# EAGLE schematic Yaris speed door lock (EAGLE 9.2.2)
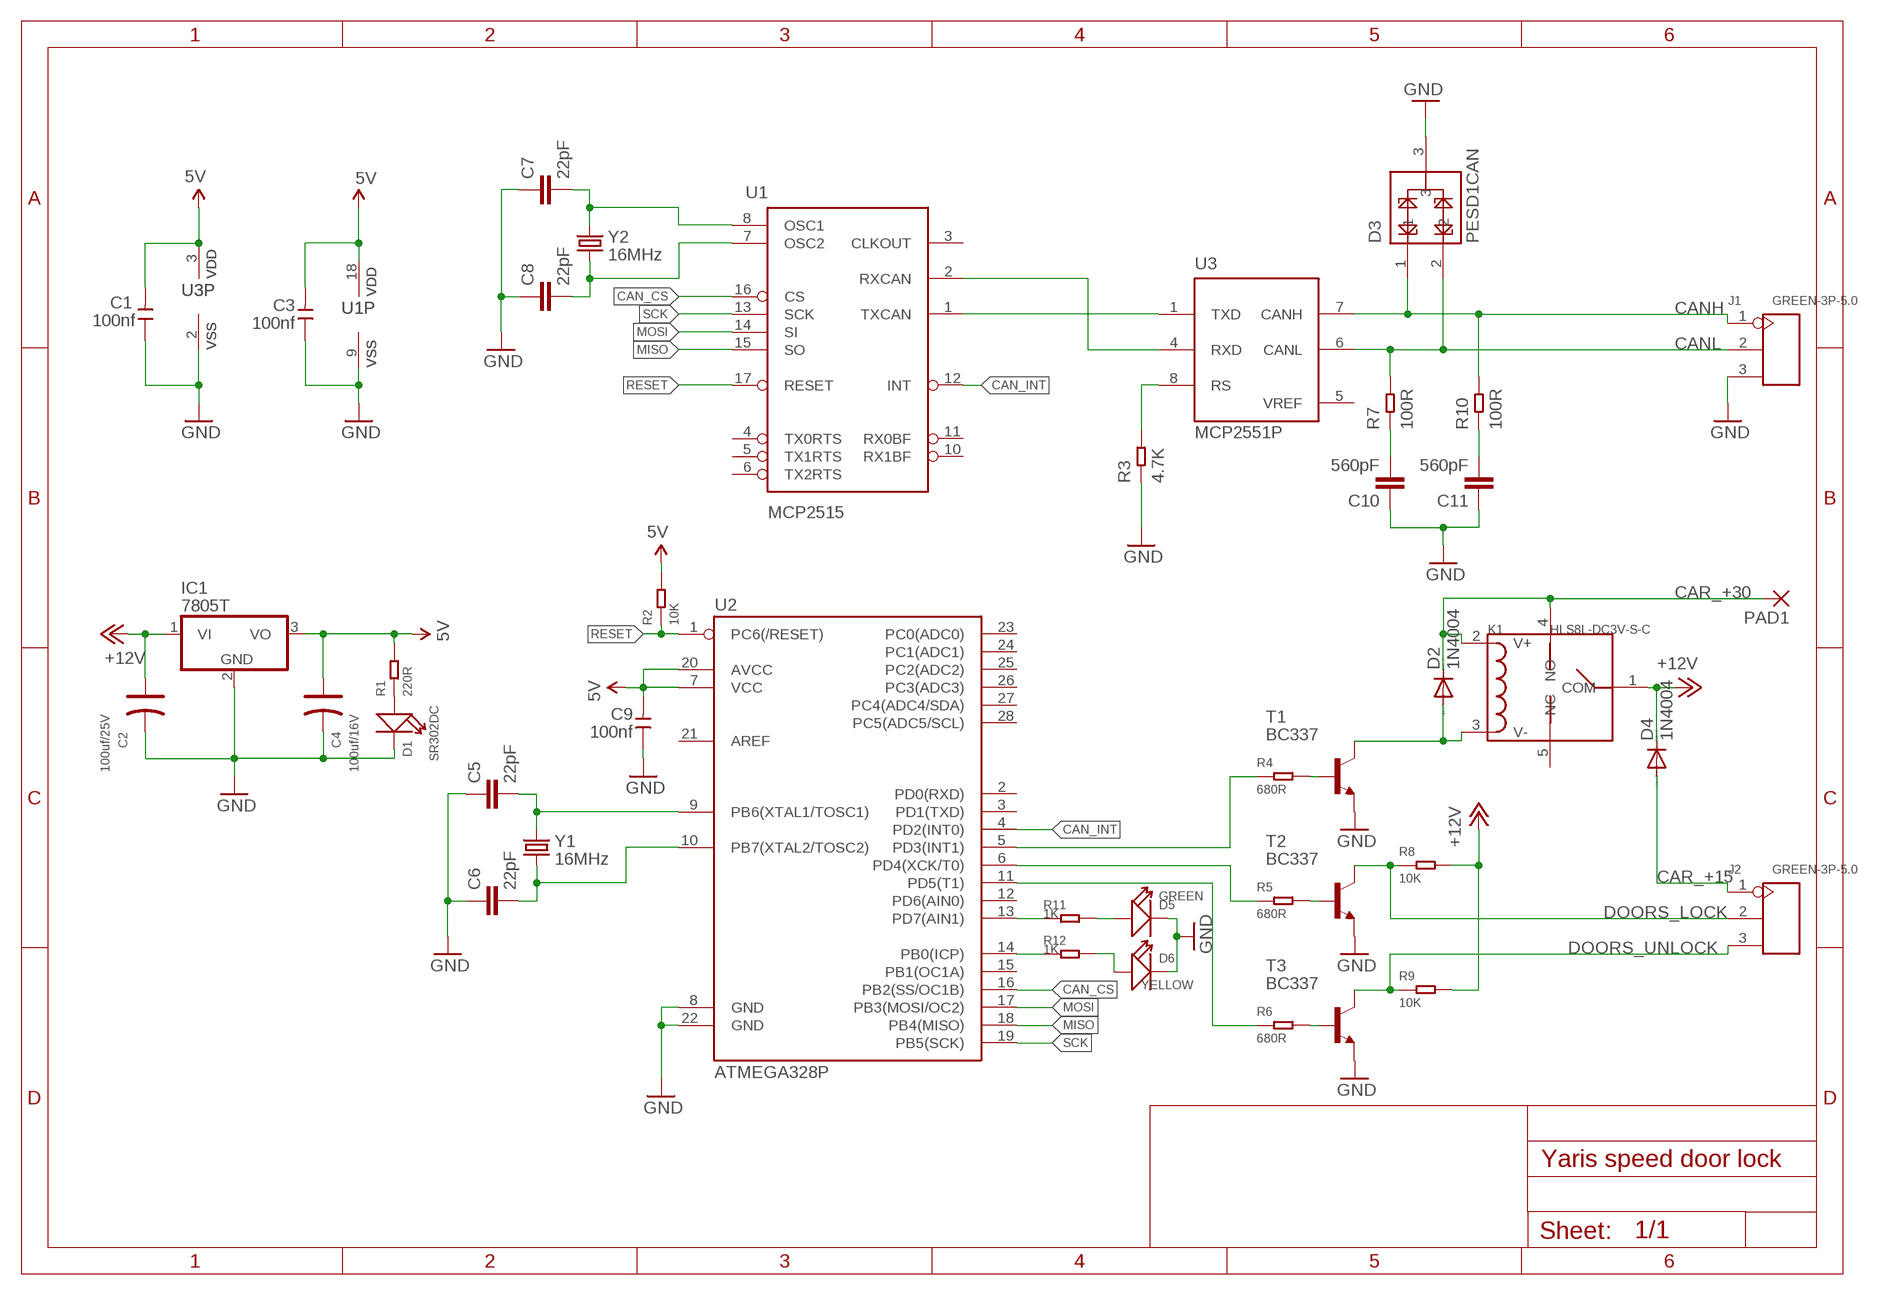
[diagram p0: schematic, sheet 1]

## Parts
C1  100nf  DIP-CERAMIC-DISC-100NF-50V-Y5V(D5.0MM)  [CERAMIC-2.54]
C2  100uf/25V  DIP-ALUMINUM-100UF-16V(D5-H7MM)  [PC-D5.3MM]
C3  100nf  DIP-CERAMIC-DISC-100NF-50V-Y5V(D5.0MM)  [CERAMIC-2.54]
C4  100uf/16V  DIP-ALUMINUM-100UF-16V(D5-H7MM)  [PC-D5.3MM]
C5  22pF  22PF-PTH-2.54MM-200V-5%  [CAP-PTH-2.54]
C6  22pF  22PF-PTH-2.54MM-200V-5%  [CAP-PTH-2.54]
C7  22pF  22PF-PTH-2.54MM-200V-5%  [CAP-PTH-2.54]
C8  22pF  22PF-PTH-2.54MM-200V-5%  [CAP-PTH-2.54]
C9  100nf  DIP-CERAMIC-DISC-100NF-50V-Y5V(D5.0MM)  [CERAMIC-2.54]
C10  560pF  560PF-50V-5%(0603)  [0603-CAP]
C11  560pF  560PF-50V-5%(0603)  [0603-CAP]
D1  SR302DC  DIP-LED-RED-RED(2P-D3MM)  [LED2-2.54-D3.0MM]
D2  1N4004  [DO41-10]
D3  PESD1CAN  [SOT23-3]
D4  1N4004  [DO41-10]
D5  GREEN  DIP-LED-GREEN-GREEN(2P-D3MM)  [LED2-2.54-D3.0MM]
D6  YELLOW  DIP-LED-GREEN-GREEN(2P-D3MM)  [LED2-2.54-D3.0MM]
IC1  7805T  [TO220H]
J1  GREEN-3P-5.0  SCREW-TERMINAL-GREEN(3P-5.0)  [H3-5.0-15.5X8.0MM]
J2  GREEN-3P-5.0  SCREW-TERMINAL-GREEN(3P-5.0)  [H3-5.0-15.5X8.0MM]
K1  HLS8L-DC3V-S-C  RELAY-HLS8L-DC3V-S-C(5P-19X15MM)  [REY5-19.0X15.0X15.0MM]
PAD1  2,15/1,0  [2,15/1,0]
R1  220R  DIP-RES-220R-5%-1/4W(PR-D2.3XL6.5MM)  [PR-D2.3XL6.5MM]
R2  10K  DIP-RES-10K-5%-1/4W(PR-D2.3XL6.5MM)  [PR-D2.3XL6.5MM]
R3  4.7K  DIP-RES-4.7K-5%-1/4W(PR-D2.3XL6.5MM)  [PR-D2.3XL6.5MM]
R4  680R  DIP-RES-680R-5%-1/4W(PR-D2.3XL6.5MM)  [PR-D2.3XL6.5MM]
R5  680R  DIP-RES-680R-5%-1/4W(PR-D2.3XL6.5MM)  [PR-D2.3XL6.5MM]
R6  680R  DIP-RES-680R-5%-1/4W(PR-D2.3XL6.5MM)  [PR-D2.3XL6.5MM]
R7  100R  DIP-RES-100R-5%-1/4W(PR-D2.3XL6.5MM)  [PR-D2.3XL6.5MM]
R8  10K  DIP-RES-10K-5%-1/4W(PR-D2.3XL6.5MM)  [PR-D2.3XL6.5MM]
R9  10K  DIP-RES-10K-5%-1/4W(PR-D2.3XL6.5MM)  [PR-D2.3XL6.5MM]
R10  100R  DIP-RES-100R-5%-1/4W(PR-D2.3XL6.5MM)  [PR-D2.3XL6.5MM]
R11  1K  DIP-RES-1K-5%-1/4W(PR-D2.3XL6.5MM)  [PR-D2.3XL6.5MM]
R12  1K  DIP-RES-1K-5%-1/4W(PR-D2.3XL6.5MM)  [PR-D2.3XL6.5MM]
T1  BC337  [TO92]
T2  BC337  [TO92]
T3  BC337  [TO92]
U1  MCP2515  MCP2510SO  [SO-18W]
U2  ATMEGA328P  ATMEGA328P_PDIP  [DIP28]
U3  MCP2551P  [DIL8]
Y1  16MHz  CRYSTALHC49US  [HC49US]
Y2  16MHz  CRYSTALHC49US  [HC49US]

## Nets
5V: C1.2 C3.2 C4.+ C9.2 IC1.3(VO) R1.2 R2.2 U1.18(VDD) U2.7(VCC) U2.20(AVCC) U3.3(VDD)
+12V: C2.+ D4.C IC1.1(VI) K1.1(COM) R8.2 R9.2
CAN_CS: U1.16(CS) U2.16(PB2(SS/OC1B))
CAN_INT: U1.12(INT) U2.4(PD2(INT0))
CAN_RXD: U1.2(RXCAN) U3.4(RXD)
CAN_TXD: U1.1(TXCAN) U3.1(TXD)
CANH: D3.1 J1.1 R10.2 U3.7(CANH)
CANL: D3.2 J1.2 R7.2 U3.6(CANL)
CAR_+15: D4.A J2.1
CAR_+30: D2.C K1.2(V+) K1.4(NO) PAD1.1(P)
DOORS_LOCK: J2.2 R8.1 T2.3(C)
DOORS_UNLOCK: J2.3 R9.1 T3.3(C)
GND: C1.1 C2.- C3.1 C4.- C5.1 C6.1 C7.1 C8.1 C9.1 C10.1 C11.1 D1.K(-) D3.3 D5.K(-) D6.K(-) IC1.2(GND) J1.3 R3.1 T1.1(E) T2.1(E) T3.1(E) U1.9(VSS) U2.8(GND) U2.22(GND) U3.2(VSS)
MISO: U1.15(SO) U2.18(PB4(MISO))
MOSI: U1.14(SI) U2.17(PB3(MOSI/OC2))
N$1: C5.2 U2.9(PB6(XTAL1/TOSC1)) Y1.2
N$2: C6.2 U2.10(PB7(XTAL2/TOSC2)) Y1.1
N$3: D1.A(+) R1.1
N$4: R4.1 U2.5(PD3(INT1))
N$5: R5.1 U2.6(PD4(XCK/T0))
N$6: R6.1 U2.11(PD5(T1))
N$7: R4.2 T1.2(B)
N$8: R5.2 T2.2(B)
N$9: C10.2 R7.1
N$10: C11.2 R10.1
N$11: R6.2 T3.2(B)
N$12: D2.A K1.3(V-) T1.3(C)
N$13: R11.1 U2.13(PD7(AIN1))
N$14: R3.2 U3.8(RS)
N$15: R12.1 U2.14(PB0(ICP))
N$16: D5.A(+) R11.2
N$17: C7.2 U1.8(OSC1) Y2.2
N$18: C8.2 U1.7(OSC2) Y2.1
N$19: D6.A(+) R12.2
RESET: R2.1 U1.17(RESET) U2.1(PC6(/RESET))
SCK: U1.13(SCK) U2.19(PB5(SCK))
Unconnected: K1.5(NC) U1.3(CLKOUT) U1.4(TX0RTS) U1.5(TX1RTS) U1.6(TX2RTS) U1.10(RX1BF) U1.11(RX0BF) U2.2(PD0(RXD)) U2.3(PD1(TXD)) U2.12(PD6(AIN0)) U2.15(PB1(OC1A)) U2.21(AREF) U2.23(PC0(ADC0)) U2.24(PC1(ADC1)) U2.25(PC2(ADC2)) U2.26(PC3(ADC3)) U2.27(PC4(ADC4/SDA)) U2.28(PC5(ADC5/SCL))

## Power pins joined to a net without a drawn wire
VREF: U3.5(VREF)

## Library data of the parts
C1 C3 C9 = OPL_Capacitor:DIP-CERAMIC-DISC-100NF-50V-Y5V(D5.0MM): 302010208; MPN: CC1-F5SL2A101KSPW
C2 C4 = OPL_Capacitor:DIP-ALUMINUM-100UF-16V(D5-H7MM): 302030031; MPN: KS 100uF/16V; VALUE: 100uf
C5-C8 = SparkFun-Capacitors:22PF: 22pF ceramic capacitors A capacitor is a passive two-terminal electrical component used to store electrical energy temporarily in an electric field.; PROD_ID: CAP-09128
C10 C11 = SparkFun-Capacitors:560PF-50V-5%(0603): CAP-08749; PROD_ID: CAP-08749
D1 = OPL_Optoelectronics:DIP-LED-RED-RED(2P-D3MM): 304090041; MPN: SR302DC
D2 D4 = diode:1N4004: DIODE general purpose rectifier, 1 A
D3 = SparkFun-DiscreteSemi:PESD1CAN: PESD1CAN is used to protect two automotive CAN bus lines from ESD.; PROD_ID: DIO-12501
D5 D6 = OPL_Optoelectronics:DIP-LED-GREEN-GREEN(2P-D3MM): 304090040; MPN: CX-G302DC; VALUE: CX-G302DC
IC1 = linear:78*: Positive VOLTAGE REGULATOR Source: http://cache.national.com/ds/LM/LM78L05.pdf http://www.fairchildsemi.com/ds/LM/LM7805.pdf
J1 J2 = OPL_Connector:SCREW-TERMINAL-GREEN(3P-5.0): 320110029
K1 = OPL_Relay:RELAY-HLS8L-DC3V-S-C(5P-19X15MM): 315030009; MPN: HLS8L-DC3V-S-C
PAD1 = wirepad:2,15/1,0: THROUGH-HOLE PAD
R1 = OPL_Resistor:DIP-RES-220R-5%-1/4W(PR-D2.3XL6.5MM): 301020011; MPN: FHCFR-1/4W-221J
R2 R8 R9 = OPL_Resistor:DIP-RES-10K-5%-1/4W(PR-D2.3XL6.5MM): 301020001; MPN: FHCFR-1/4W-103J
R3 = OPL_Resistor:DIP-RES-4.7K-5%-1/4W(PR-D2.3XL6.5MM): 301020012; MPN: FHCFR-1/4W-472J
R4-R6 = OPL_Resistor:DIP-RES-680R-5%-1/4W(PR-D2.3XL6.5MM): 301020007; MPN: FHCFR-1/4W-681J
R7 R10 = OPL_Resistor:DIP-RES-100R-5%-1/4W(PR-D2.3XL6.5MM): 301020017; MPN: FHCFR-1/4W-101J
R11 R12 = OPL_Resistor:DIP-RES-1K-5%-1/4W(PR-D2.3XL6.5MM): 301020000; MPN: FHCFR-1/4W-102J
T1-T3 = transistor:BC337: NPN TRANSISTOR
U1 = SparkFun-DigitalIC:MCP2510: CAN controller with SPI interface to any MCU. Original design by Microchip.; PROD_ID: IC-09906
U2 = SparkFun-IC-Microcontroller:ATMEGA328P_PDIP: Atmel 328P Through hole ATMEGA328P uC used in the Arduino 32kb flash, 1k EEPROM, 2k SRAM Datasheet <http://www.sparkfun.com/datasheets/Components/SMD/ATMega328.pdf> SparkFun Products Storefront component: AVR 28 Pin 20MHz 32K 6A/D - ATMega328P <https://www.sparkfun.com/products/9061> (COM-09061) SparkFun Simon Says - Through-Hole Soldering Kit <https://www.sparkfun.com/products/10547> (KIT-10547) SparkFun Learn to Solder - Simon Says <https://www.sparkfun.com/products/13708> (KIT-13708) SparkFun BigTime Watch Kit <https://www.sparkfun.com/products/11734> (KIT-11734) SparkFun ClockIt <https://www.sparkfun.com/products/10930> (KIT-10930) SparkFun Serial Enabled LCD Kit <https://www.sparkfun.com/products/10097> (LCD-10097) SparkFun Simon Tilts - Through Hole Soldering Kit <https://www.sparkfun.com/products/12634> (KIT-12634) SparkFun Frequency Counter Kit <https://www.sparkfun.com/products/10140> (KIT-10140) FabFM Radio Kit <https://www.sparkfun.com/products/11043> (KIT-11043) SparkFun Binary Blaster Kit <https://www.sparkfun.com/products/12037> (KIT-12037) SparkFun Metro-Gnome <https://www.sparkfun.com/products/9236> (KIT-09236) ATmega328 with Arduino Optiboot (Uno) <https://www.sparkfun.com/products/10524> (DEV-10524); PROD_ID: IC-09136; VALUE: 328P
U3 = microchip_can:MCP2551: High Speed CAN tranceiver
Y1 Y2 = SparkFun-FreqCtrl:CRYSTAL: Various standard crystals. Proven footprints.